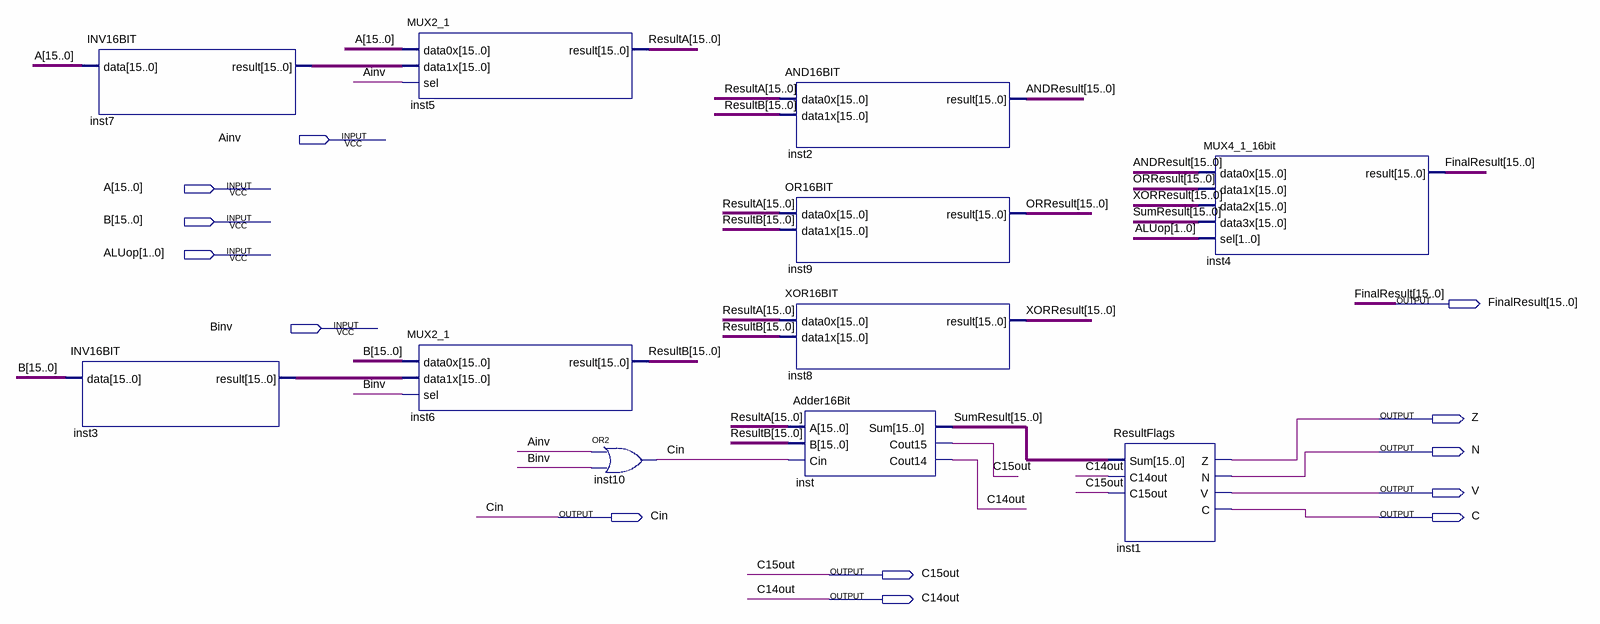
[diagram p0: schematic sheet]
// Quartus schematic ALU16Bit.bdf as structural Verilog: 11 symbols, 13 pins
module ALU16Bit (
  input  Ainv,
  input  [15:0] A,
  input  [15:0] B,
  input  [1:0] ALUop,
  input  Binv,
  output [15:0] FinalResult,
  output Z,
  output N,
  output V,
  output Cin,
  output C,
  output C15out,
  output C14out
);

  wire [15:0] ANDResult, inst3_result, inst7_result, ORResult, ResultA, ResultB, SumResult, XORResult;

  INV16BIT inst3 (.data(B), .result(inst3_result));
  INV16BIT inst7 (.data(A), .result(inst7_result));
  MUX2_1 inst5 (.data0x(A), .data1x(inst7_result), .sel(Ainv), .result(ResultA));
  MUX2_1 inst6 (.data0x(B), .data1x(inst3_result), .sel(Binv), .result(ResultB));
  or inst10 (Cin, Ainv, Binv);
  AND16BIT inst2 (.data0x(ResultA), .data1x(ResultB), .result(ANDResult));
  OR16BIT inst9 (.data0x(ResultA), .data1x(ResultB), .result(ORResult));
  XOR16BIT inst8 (.data0x(ResultA), .data1x(ResultB), .result(XORResult));
  Adder16Bit inst (.A(ResultA), .B(ResultB), .Cin(Cin), .Sum(SumResult), .Cout15(C15out), .Cout14(C14out));
  ResultFlags inst1 (.Sum(SumResult), .C14out(C14out), .C15out(C15out), .Z(Z), .N(N), .V(V), .C(C));
  MUX4_1_16bit inst4 (
    .data0x(ANDResult), .data1x(ORResult), .data2x(XORResult), .data3x(SumResult), .sel(ALUop),
    .result(FinalResult));
endmodule
